# EasyEDA schematic rx.json
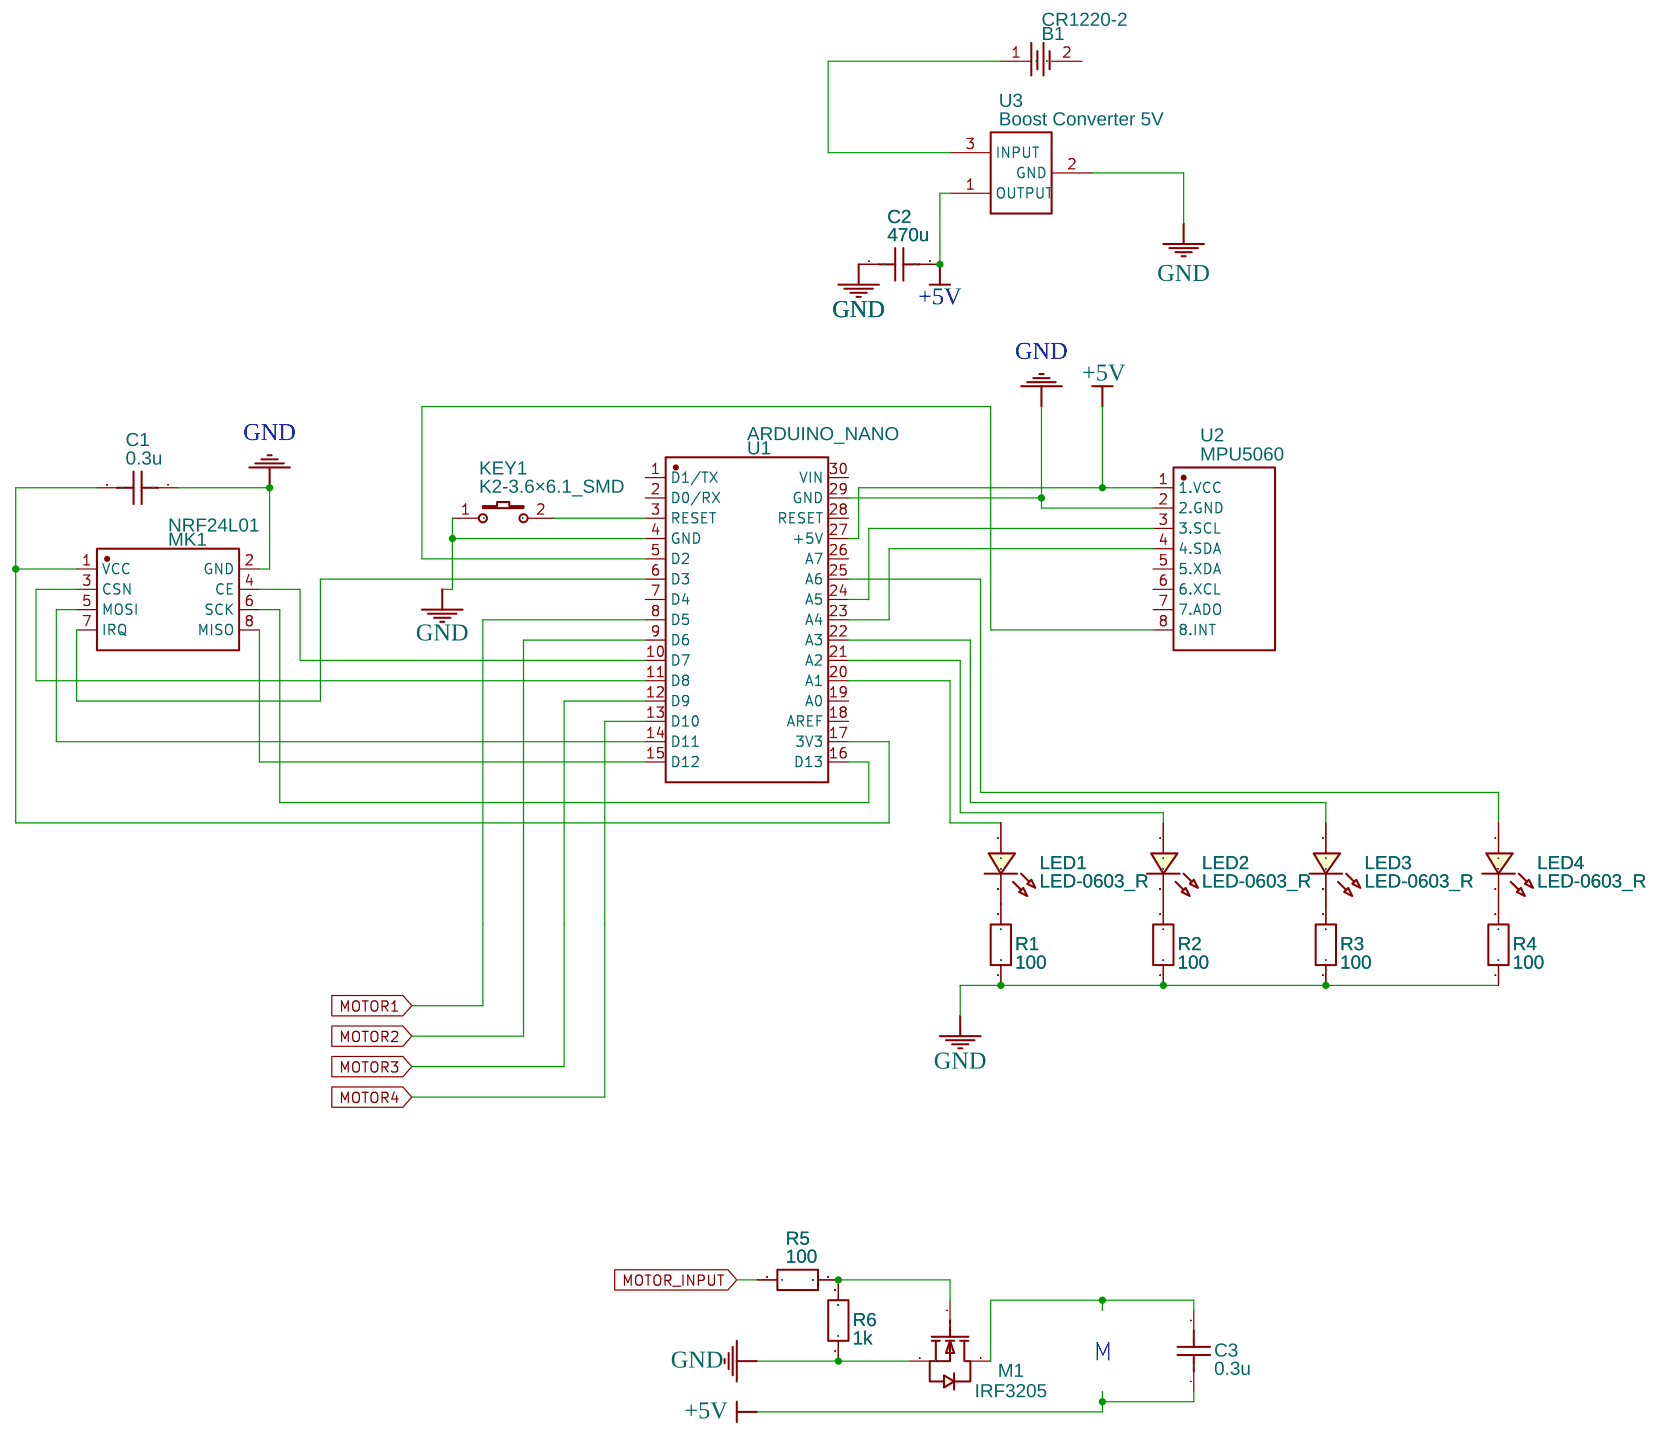
[diagram p0: schematic sheet]

## Parts
B1  CR1220-2  [BAT-SMD_CR1220-2]
C1  0.3u  [C0603]
C2  470u  [C0603]
C3  0.3u  [C0603]
KEY1  K2-3.6×6.1_SMD  [KEY-SMD_2P-L6.2-W3.6-LS8.0]
LED1  LED-0603_R  [LED0603_RED]
LED2  LED-0603_R  [LED0603_RED]
LED3  LED-0603_R  [LED0603_RED]
LED4  LED-0603_R  [LED0603_RED]
M1  IRF3205  [IRF3205PBF]
MK1  NRF24L01  [WIRELM-SMD_NRF24L01]
R1  100  [R0603]
R2  100  [R0603]
R3  100  [R0603]
R4  100  [R0603]
R5  100  [R0603]
R6  1k  [R0603]
U1  ARDUINO_NANO  [COMM-TH_ARDUINO_NANO]
U2  MPU5060  [IMA MERLIM_MPU-6050]
U3  Boost Converter 5V  [BOOST CONVERTER 5V]

## Library data of the parts
B1 = CR1220-2: Supplier: LCSC; Manufacturer: Q&J; image: //image.lceda.cn/szlcsc/C70381.jpg; Supplier Part: C70381
C1-C3 = C_0603_US: Contributor: LCEDA_Lib
KEY1 = K2-3.6×6.1_SMD: Supplier Part: C118141; Supplier: LCSC; Manufacturer Part: K2-1107ST-A4SW-06; Contributor: LCEDA_Lib; 制造商: 韩国韩荣
LED1-LED4 = LED-0603_R: Manufacturer: EVERLIGHT(台湾亿光); Manufacturer Part: 19-217/R6C-AL1M2VY/3T; Supplier Part: C72044; Supplier: LCSC; Contributor: LCEDA_01
M1 = IRF3205PBF: Supplier: LCSC; Manufacturer: IR; image: //image.lceda.cn/szlcsc/C2561.jpg; Supplier Part: C2561; LCSC Assembly: Yes; SMT Type: Extend; Contributor: Вадим Ярков
MK1 = NRF24L01: Supplier: LCSC; Manufacturer: Ai-Thinker(安信可); Manufacturer Part: NF-04; Supplier Part: C90751; JLCPCB Part Class: Extended Part
R1-R6 = R_0603_EU: Contributor: LCEDA_Lib
U1 = ARDUINO_NANO: Contributor: lcsc; Supplier: LCSC; Supplier Part: C9900017879; Manufacturer: null; JLCPCB Part Class: Extended Part
U2 = Ima Merlin_04171032_MPU5060: Contributor: engineerfil206
U3 = Boost Converter 5V: link: https://fr.aliexpress.com/item/32834541216.html?spm=a2g0o.productlist.0.0.1a091ca10I950T&algo_pvid=930ec1d6-e77d-49f9-9165-6a3cfcf7e109&algo_expid=930ec1d6-e77d-49f9-9165-6a3cfcf7e109-28&btsid=2100bb4716116849933554293e2287&ws_ab_test=searchweb0_0,searchweb201602_,searchweb201603_; Contributor: thibauthennon

## Nets
+5V: C2.2 C3.1 U1.27(+5V) U2.1(1.VCC) U3.1(OUTPUT)
GND: C1.1 C2.1 KEY1.1 M1.3(S) MK1.2(GND) R1.1 R2.1 R3.1 R4.1 R6.1 U1.4(GND) U1.29(GND) U2.2(2.GND) U3.2(GND)
MOTOR1: U1.8(D5)
MOTOR2: U1.9(D6)
MOTOR3: U1.12(D9)
MOTOR4: U1.13(D10)
MOTOR_INPUT: R5.1
Net-(B1-1): B1.1 U3.3(INPUT)
Net-(C1-2): C1.2 MK1.1(VCC) U1.17(3V3)
Net-(C3-2): C3.2 M1.2(D)
Net-(KEY1-2): KEY1.2 U1.3(RESET)
Net-(LED1-1): LED1.1 U1.20(A1)
Net-(LED1-2): LED1.2 R1.2
Net-(LED2-1): LED2.1 U1.21(A2)
Net-(LED2-2): LED2.2 R2.2
Net-(LED3-1): LED3.1 U1.22(A3)
Net-(LED3-2): LED3.2 R3.2
Net-(LED4-1): LED4.1 U1.25(A6)
Net-(LED4-2): LED4.2 R4.2
Net-(M1-1): M1.1(G) R5.2 R6.2
Net-(MK1-3): MK1.3(CSN) U1.11(D8)
Net-(MK1-4): MK1.4(CE) U1.10(D7)
Net-(MK1-5): MK1.5(MOSI) U1.14(D11)
Net-(MK1-6): MK1.6(SCK) U1.16(D13)
Net-(MK1-7): MK1.7(IRQ) U1.6(D3)
Net-(MK1-8): MK1.8(MISO) U1.15(D12)
Net-(U1-5): U1.5(D2) U2.8(8.INT)
Net-(U1-23): U1.23(A4) U2.4(4.SDA)
Net-(U1-24): U1.24(A5) U2.3(3.SCL)

Not connected (* = marked no-connect by the designer): B1 2; U1 1(D1/TX) 2(D0/RX) 7(D4) 18(AREF) 19(A0) 26(A7) 28(RESET) 30(VIN); U2 5(5.XDA) 6(6.XCL) 7(7.ADO)

## Notes on the sheet
- M
